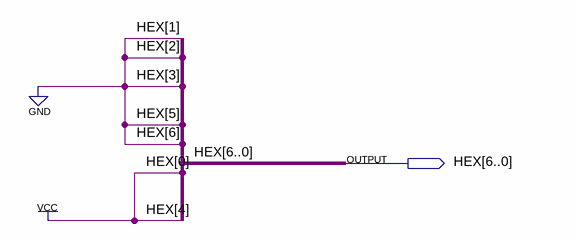
[diagram p0: schematic sheet]
// Quartus schematic Yes.bdf as structural Verilog: 0 symbols, 1 pins
module Yes (
  output [6:0] HEX
);


  assign HEX = 7'b0010001;
endmodule
